# Altium schematic sheet PSU.SchDoc: NB3000 POWER SUPPLIES
size A4; Organization: Altium Limited.; Address1: 3 Minna Close; Address2: Belrose; Address3: NSW 2085; Address4: AUSTRALIA; DocumentNumber: 7; Revision: 6; SheetNumber: 8; SheetTotal: 78
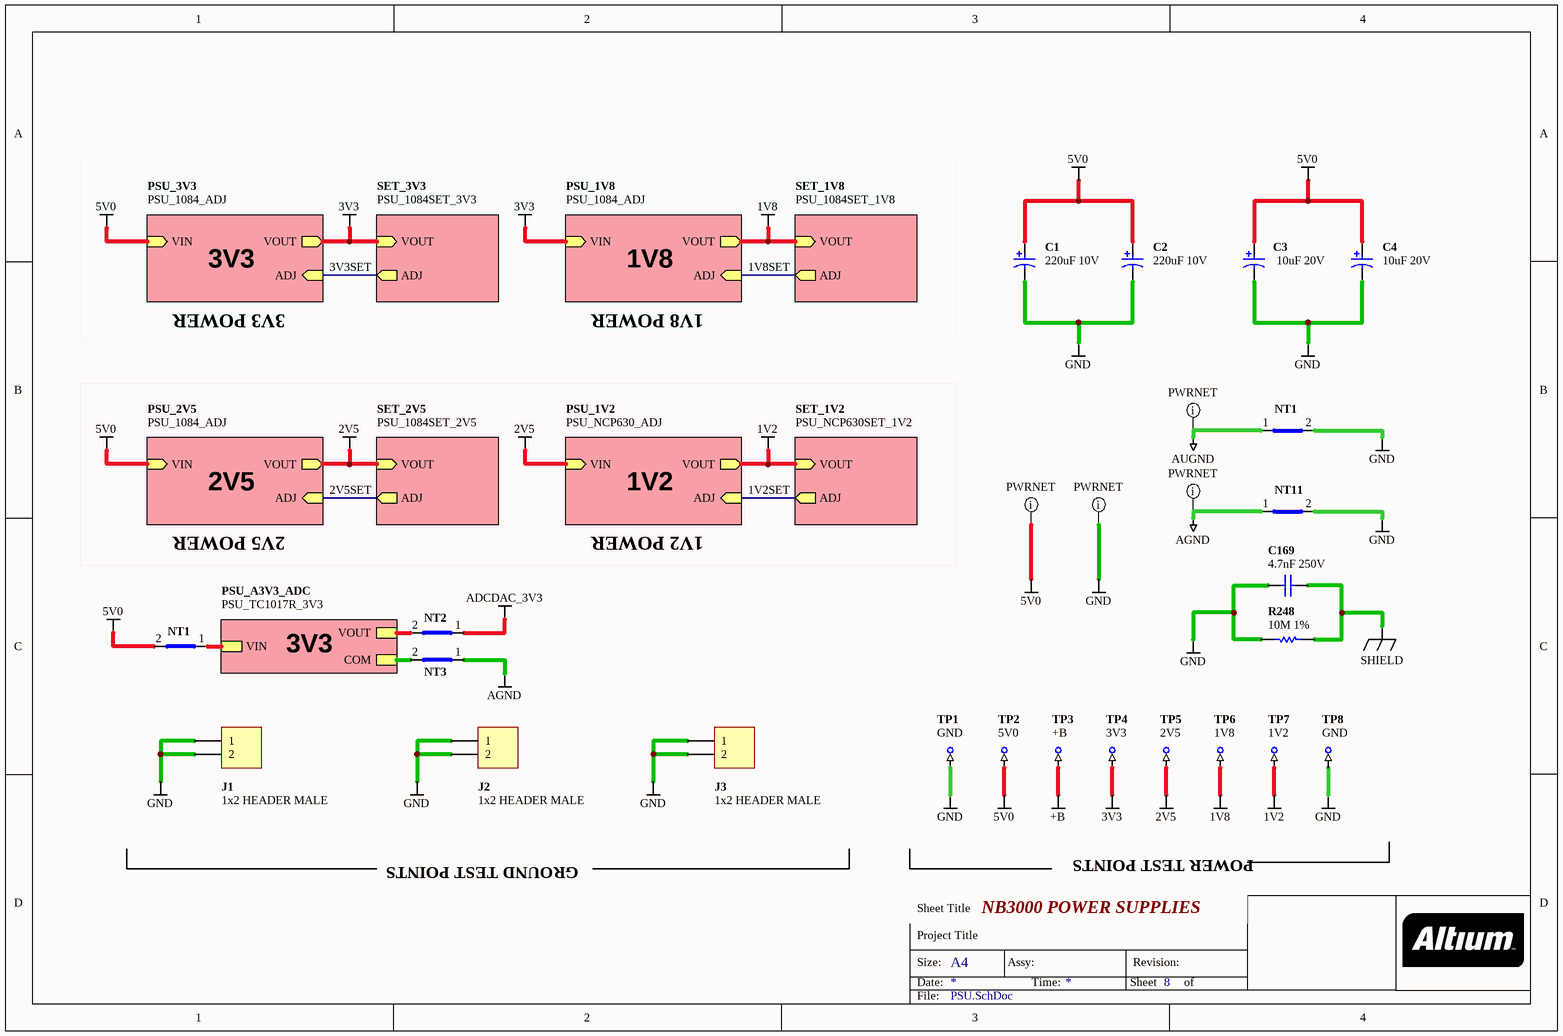
[diagram p0: PSU.SchDoc]

## Parts
(Parts that share a designator on the sheet are numbered #1, #2 ... from top to bottom, then left to right.)
C1  220uF 10V  [CAPC7343-STAR]
C2  220uF 10V  [CAPC7343-STAR]
C3  10uF 20V  [CAPC3528-STAR]
C4  10uF 20V  [CAPC3528-STAR]
C169  4.7nF 250V  [CAPM7163]
J1  1x2 HEADER MALE  [HDR1X2]
J2  1x2 HEADER MALE  [HDR1X2]
J3  1x2 HEADER MALE  [HDR1X2]
NT1#1  Net Tie SMT2  [NETTIE-SMT2-31X39]  (value not drawn)  (net tie, no BOM)
NT1#2  Net Tie SMT2  [NETTIE-SMT2-31X51]  (value not drawn)  (net tie, no BOM)
NT2  Net Tie SMT2  [NETTIE-SMT2-31X51]  (value not drawn)  (net tie, no BOM)
NT3  Net Tie SMT2  [NETTIE-SMT2-31X51]  (value not drawn)  (net tie, no BOM)
NT11  Net Tie SMT2  [NETTIE-SMT2-31X39]  (value not drawn)  (net tie, no BOM)
R248  10M 1%  [RESC3216]
TP1  GND  [TestPin]  (no BOM)
TP2  5V0  [TestPin]  (no BOM)
TP3  +B  [TestPin]  (no BOM)
TP4  3V3  [TestPin]  (no BOM)
TP5  2V5  [TestPin]  (no BOM)
TP6  1V8  [TestPin]  (no BOM)
TP7  1V2  [TestPin]  (no BOM)
TP8  GND  [TestPin]  (no BOM)

## Sub-sheets
PSU_1V2 = PSU_NCP630_ADJ: VIN (in), VOUT (out), ADJ (in)
PSU_1V8 = PSU_1084_ADJ: VIN (in), VOUT (out), ADJ (in)
PSU_2V5 = PSU_1084_ADJ: VIN (in), VOUT (out), ADJ (in)
PSU_3V3 = PSU_1084_ADJ: VIN (in), VOUT (out), ADJ (in)
PSU_A3V3_ADC = PSU_TC1017R_3V3: VIN, VOUT, COM
SET_1V2 = PSU_NCP630SET_1V2: VOUT (in), ADJ (out)
SET_1V8 = PSU_1084SET_1V8: VOUT (in), ADJ (out)
SET_2V5 = PSU_1084SET_2V5: VOUT (in), ADJ (out)
SET_3V3 = PSU_1084SET_3V3: VOUT (in), ADJ (out)

## Nets
1V2: TP7.1 ; sheet PSU_1V2/VOUT, sheet SET_1V2/VOUT
1V8: TP6.1 ; sheet PSU_1V8/VOUT, sheet SET_1V8/VOUT
2V5: TP5.1 ; sheet PSU_1V2/VIN, sheet PSU_2V5/VOUT, sheet SET_2V5/VOUT
3V3: TP4.1 ; sheet PSU_1V8/VIN, sheet PSU_3V3/VOUT, sheet SET_3V3/VOUT
5V0: C1.1 C2.1 C3.1 C4.1 NT1#2.2(Net2) TP2.1 ; sheet PSU_2V5/VIN, sheet PSU_3V3/VIN
+B: TP3.1
ADCDAC_3V3: NT2.1(Net1)
AGND: NT3.1(Net1) NT11.1(Net1)
AUGND: NT1#1.1(Net1)
GND: C1.2 C2.2 C3.2 C4.2 C169.2 J1.1 J1.2 J2.1 J2.2 J3.1 J3.2 NT1#1.2(Net2) NT11.2(Net2) R248.2 TP1.1 TP8.1
SHIELD: C169.1 R248.1
1V2SET: sheet PSU_1V2/ADJ, sheet SET_1V2/ADJ
1V8SET: sheet PSU_1V8/ADJ, sheet SET_1V8/ADJ
2V5SET: sheet PSU_2V5/ADJ, sheet SET_2V5/ADJ
3V3SET: sheet PSU_3V3/ADJ, sheet SET_3V3/ADJ
NetNT1#2_1: NT1#2.1(Net1) ; sheet PSU_A3V3_ADC/VIN
NetNT2_2: NT2.2(Net2) ; sheet PSU_A3V3_ADC/VOUT
NetNT3_2: NT3.2(Net2) ; sheet PSU_A3V3_ADC/COM

## Layout directives
net class PWRNET: 5V0, AGND, AUGND, GND

## Notes on the sheet
- 3V3
- 3V3 POWER
- 1V8
- 1V8 POWER
- 2V5
- 1V2
- 2V5 POWER
- 1V2 POWER
- POWER TEST POINTS
- GROUND TEST POINTS
- Sheet Title
- Project Title
- Size:
- Date:
- A4
- Assy:
- Time:
- Sheet
- Revision:
- of
- File:

## Library data of the parts
C1 C2 = D-101-0088: Capacitor, Tantalum, 220uF 10% 10V MCCT-D (7343-31); Polarity: Polarized; Category: Capacitor; Capacitance: 220 uF; Mounting Technology: Surface Mount; Rated Voltage: 10 V; Status: Unreleased; Technology: Tantalum; Tolerance: 10 %
C3 C4 = D-101-0007: Capacitor, Tantalum, 10uF 10% 20V MCCT-B (3528); Polarity: Polarized; Category: Capacitor; Status: Production; Capacitance: 10 uF; Mounting Technology: Surface Mount; Rated Voltage: 20 V; Technology: Tantalum; Tolerance: 10 %
C169 = D-101-0019: Capacitor, Ceramic, 4.7nF 20% 250V Panasonic BC J Lead (CAPM7163) Y5V; Polarity: Non-Polarized; Tolerance: 20% %; Category: Capacitor; Capacitance: 4.7 nF; Dielectric: Y5V; Mounting Technology: Surface Mount; Rated Voltage: 250 V; Status: Production; Technology: Ceramic
J1-J3 = D-300-0020: Header IDC, 2 x 1 Pin Vertical 2.54mm Pitch (Non-Boxed, Male); Max Current: 3 A; Category: Connector; Connector type: Header; Mounting Technology: Through-Hole; Pin Count: 2; Status: Production
NT1#1 NT11 = D-002-0004: Net-Tie, Surface Mount, 2 x 2.0mm x 0.8mm SMT Pads - For 0.8mm Track; Status: Production; Category: Net-Tie
NT1#2 NT2 NT3 = D-002-0003: Net-Tie, Surface Mount, 2 x 1.6mm x 0.8mm SMT Pads - For 0.8mm Track; Category: Net-Tie; Status: Production
R248 = D-100-0059: Resistor, 10M 1%1206 (3216); Power Rating: 250 mW; Category: Resistor; Mounting Technology: Surface Mount; Resistance: 10 M; Status: Deprecated; Tolerance: 1 %
TP1-TP8 = D-006-0000: Test Point, PCB Mount with Silkscreen Box; Category: Test-Point; Status: Production